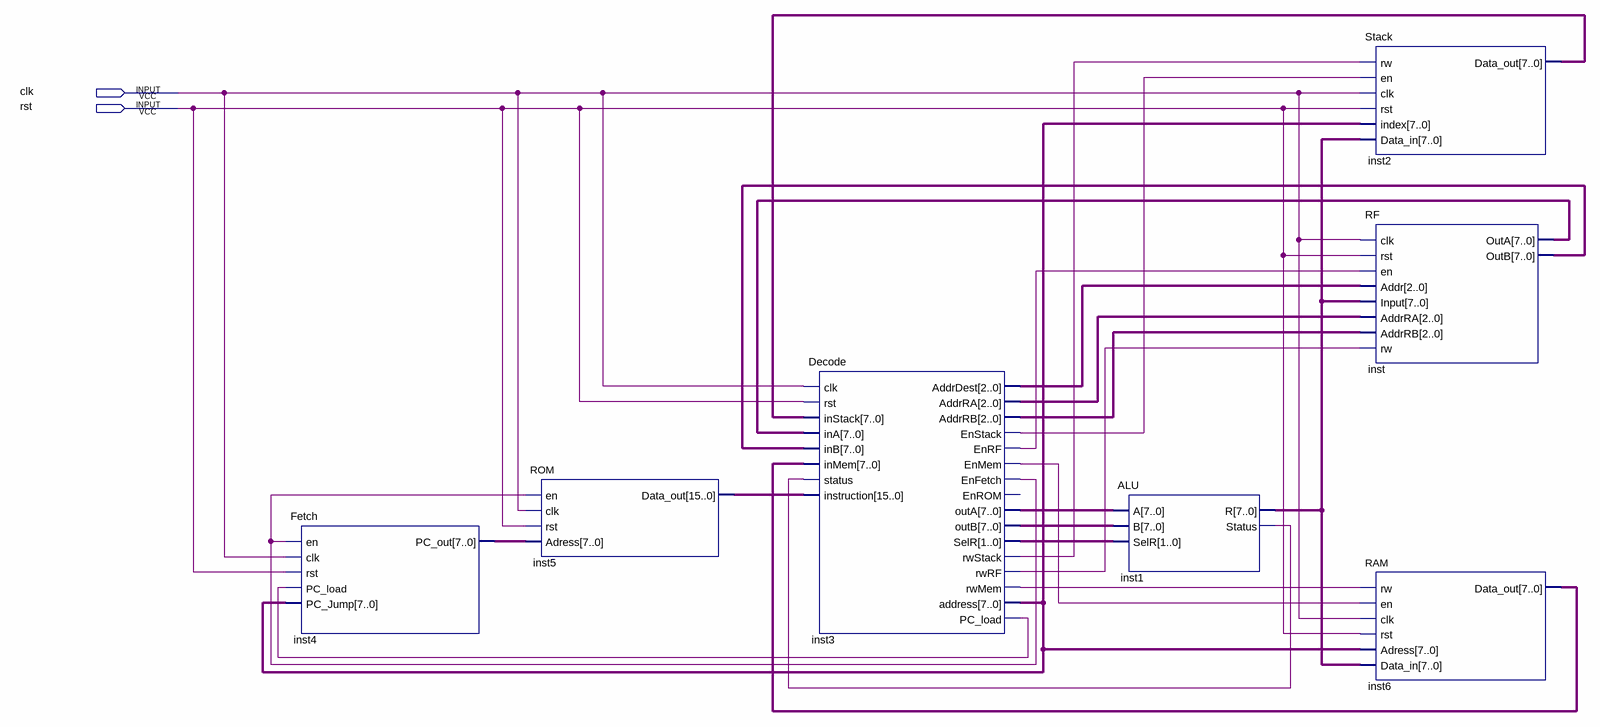
[diagram p0: schematic sheet]
// Quartus schematic CPU.bdf as structural Verilog: 7 symbols, 2 pins
module CPU (
  input  clk,
  input  rst
);

  wire inst1_status, inst3_enfetch, inst3_enmem, inst3_enrf, inst3_enstack, inst3_pc_load, inst3_rwmem,
       inst3_rwrf, inst3_rwstack;
  wire [1:0] inst3_selr;
  wire [2:0] inst3_addrdest, inst3_addrra, inst3_addrrb;
  wire [7:0] inst1_r, inst2_data_out, inst3_address, inst3_outa, inst3_outb, inst4_pc_out, inst6_data_out,
       inst_outa, inst_outb;
  wire [15:0] inst5_data_out;

  Fetch inst4 (
    .en(inst3_enfetch), .clk(clk), .rst(rst), .PC_load(inst3_pc_load), .PC_Jump(inst3_address),
    .PC_out(inst4_pc_out));
  ROM inst5 (.en(inst3_enfetch), .clk(clk), .rst(rst), .Adress(inst4_pc_out), .Data_out(inst5_data_out));
  Decode inst3 (
    .clk(clk), .rst(rst), .inStack(inst2_data_out), .inA(inst_outa), .inB(inst_outb), .inMem(inst6_data_out),
    .status(inst1_status), .instruction(inst5_data_out), .AddrDest(inst3_addrdest), .AddrRA(inst3_addrra),
    .AddrRB(inst3_addrrb), .EnStack(inst3_enstack), .EnRF(inst3_enrf), .EnMem(inst3_enmem),
    .EnFetch(inst3_enfetch), .outA(inst3_outa), .outB(inst3_outb), .SelR(inst3_selr),
    .rwStack(inst3_rwstack), .rwRF(inst3_rwrf), .rwMem(inst3_rwmem), .address(inst3_address),
    .PC_load(inst3_pc_load));  // open: EnROM
  ALU inst1 (.A(inst3_outa), .B(inst3_outb), .SelR(inst3_selr), .R(inst1_r), .Status(inst1_status));
  Stack inst2 (
    .rw(inst3_rwstack), .en(inst3_enstack), .clk(clk), .rst(rst), .index(inst3_address), .Data_in(inst1_r),
    .Data_out(inst2_data_out));
  RF inst (
    .clk(clk), .rst(rst), .en(inst3_enrf), .Addr(inst3_addrdest), .Input(inst1_r), .AddrRA(inst3_addrra),
    .AddrRB(inst3_addrrb), .rw(inst3_rwrf), .OutA(inst_outa), .OutB(inst_outb));
  RAM inst6 (
    .rw(inst3_rwmem), .en(inst3_enmem), .clk(clk), .rst(rst), .Adress(inst3_address), .Data_in(inst1_r),
    .Data_out(inst6_data_out));
endmodule
